# Altium project buck coverter LMR14030SDDAR.PrjPcb
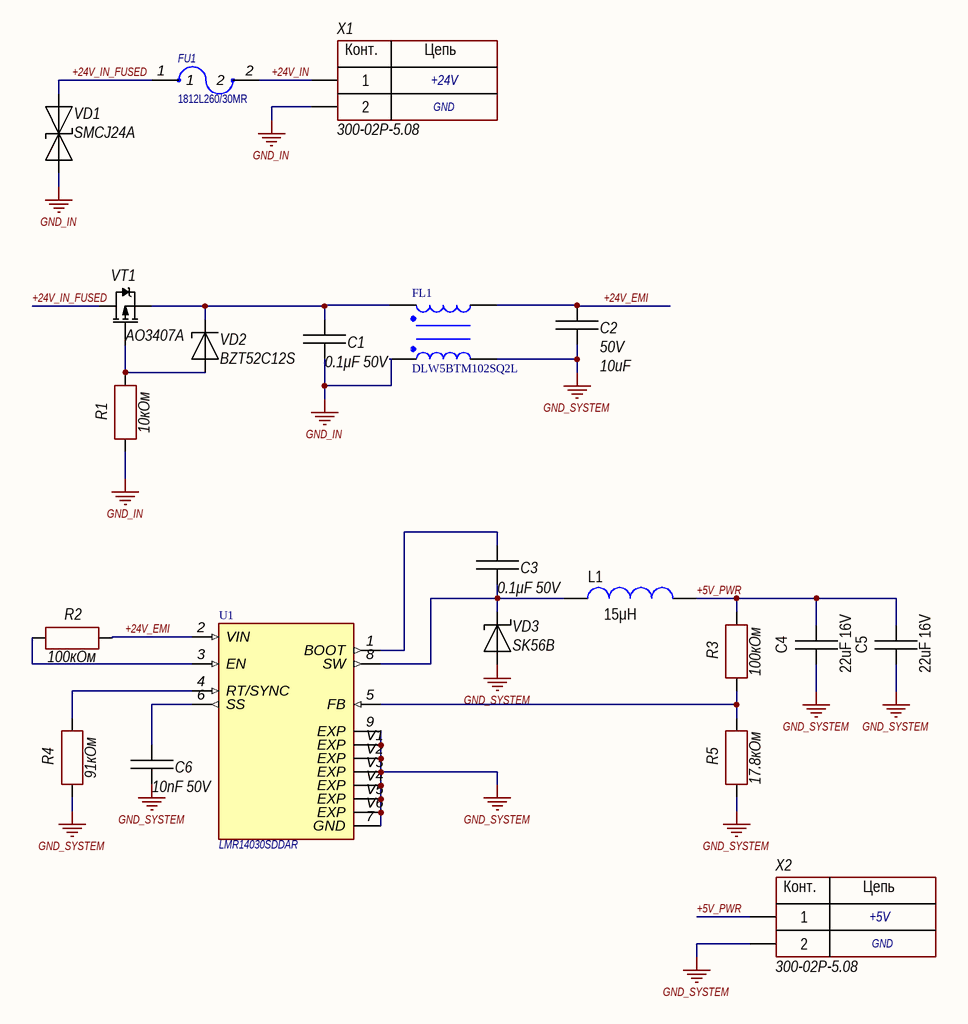
[diagram p0: converter schematic.SchDoc]
1 sheet, 21 parts. Net scope: global (net labels, ports and power ports of the same name join across sheets).
Board file: converter pcb.PcbDoc

## Sheet converter schematic.SchDoc
size 209 x 297 mm

### Parts
C1  value 0.1μF 50V  [CAP: 0603]
C2  value 10uF  Voltage: 50V  [CAP: 1210]
C3  value 0.1μF 50V  [CAP: 0603]
C4  22uF 16V  [CH1206C]
C5  22uF 16V  [CH1206C]
C6  value 10nF 50V  [CAP: 0603]
FL1  DLW5BTM102SQ2L  [FIL_DLW5BTM102SQ2L]
FU1  1812L260/30MR  [FUSM4632X200N]
L1  SRP1265A-150M: 15μH  [IND: SRP1265A]
R1  10кОм  [CH0603R]
R2  100кОм  [CH0603R]
R3  100кОм  [CH0603R]
R4  91кОм  [CH0603R]
R5  17.8кОм  [CH0603R]
U1  LMR14030SDDAR  [SOIC127P600X170-9N]
VD1  SMCJ24A  [SMC]
VD2  BZT52C12S  [SOD323]
VD3  PartNumber: SK56B  [DIODE: SMB]
VT1  AO3407A  [SOT23_132]
X1  300-02P-5.08  [CON: 300-02P-5.08]
X2  300-02P-5.08  [CON: 300-02P-5.08]

### Nets
GND_IN: C1.1 FL1.4 R1.1 VD1.2(C) X1.2
GND_SYSTEM: C2.1 C4.1 C5.1 C6.1 FL1.3 R4.1 R5.1 U1.7(GND) U1.9(EXP) U1.V1(EXP) U1.V2(EXP) U1.V3(EXP) U1.V4(EXP) U1.V5(EXP) U1.V6(EXP) VD3.1 X2.2
+5V_PWR: C4.2 C5.2 L1.1 R3.2 X2.1
+24V_EMI: C2.2 FL1.2 R2.2 U1.2(VIN)
+24V_IN: FU1.2 X1.1
+24V_IN_FUSED: FU1.1 VD1.1(A) VT1.2(D)
NetC1_2: C1.2 FL1.1 VD2.2(C) VT1.3(S)
NetC3_1: C3.1 L1.2 U1.8(SW) VD3.2
NetC3_2: C3.2 U1.1(BOOT)
NetC6_2: C6.2 U1.6(SS)
NetR1_2: R1.2 VD2.1(A) VT1.1(G)
NetR2_1: R2.1 U1.3(EN)
NetR3_1: R3.1 R5.2 U1.5(FB)
NetR4_2: R4.2 U1.4(RT/SYNC)

### Notes on the sheet
- +24V
- GND
- +5V
- Подп. и дата
- Инв. № дубл.
- Взам. инв. №
- Инв. № подл.
- Изм.
- Лист
- № докум.
- Подп.
- Дата
- Форма 2а ГОСТ 2.104-2006
- Копировал
- Формат А4
- (in symbol 2-Connector) Конт.; Цепь

### Library data of the parts
C1 C3 C6 = Ceramic_0603: Manufacturer: Yageo; PartNumber: CC0603KRX7R7BB104; TypeCapacitor: Ceramic capacitor; Tolerance: ±10%; TypeDielectric: X7R; Package: 0603; HelpURL: https://www.digikey.com/product-detail/en/yageo/CC0603KRX7R7BB104/311-1088-1-ND/302998; ValueManufacturerPartNumber: =TypeCapacitor+', '+Value+', '+TypeDielectric+', '+Tolerance+', '+Voltage+', '+Package+', '+Temperature; Temperature: -55...+125°C
C2 = Ceramic_1210: Manufacturer: Yageo; PartNumber: CC1210KKX7R9BB104; ValueManufacturerPartNumber: Ceramic capacitor, 10uF, X7R, ±10%, 50V, 1210, -55...+125°C; TypeCapacitor: Ceramic capacitor; Tolerance: ±10%; TypeDielectric: X7R; Package: 1210; HelpURL: https://www.digikey.com/product-detail/en/yageo/CC1210KKX7R9BB104/311-4522-1-ND/8025611; Temperature: -55...+125°C
C4 C5 = Capacitor: Manufacturer: *; Model: *; HelpURL: *; ComponentKind: *; Value: *
FL1 = DLW5BTM102SQ2L: 2 Line Common Mode Choke Surface Mount 1 kOhms @ 100MHz 2A DCR 34mOhm; MF: Murata; Price: None; Availability: Unavailable; SnapEDA_Link: https://www.snapeda.com/parts/DLW5BTM102SQ2L/Murata/view-part/4300900/?ref=snap; MP: DLW5BTM102SQ2L; Value: *; Package: Horizontal-6 Murata
FU1 = 1812L110PRT: PTC Resettable Fuse 1.1A(hold) 1.95A(trip) 33VDC 20A 0.8W 0.5s 0.06Ohm SMD Solder Pad 1812 T/R; Package: None; Price: None; Value: *; MP: 1812L110PRT; Availability: Unavailable
L1 = Inductor_SRP1265A: Manufacturer: Bourns; PartNumber: SRP1265A-4R7M; TypeInductor: Fixed inductor; MaxCurrent: 13.5A; Package: SRP1265A; HelpURL: https://www.digikey.com/product-detail/en/bourns-inc/SRP1265A-4R7M/SRP1265A-4R7MCT-ND/4876721; ValueManufacturerPartNumber: =TypeInductor+', '+Value+', '+Tolerance+', '+Package+', '+MaxCurrent+', '+Temperature; Temperature: -40...+150°C
R1 = Resistor: Manufacturer: *; Model: *; HelpURL: *; ComponentKind: *; Value: 10кОм
R2-R5 = Resistor: Value: 10кОм; Manufacturer: *; Model: *; HelpURL: *; ComponentKind: *
U1 = LMR14030SDDAR: SIMPLE SWITCHERÂ® 40-V, 3.5-A, 2.2-MHz step-down converter with 40-uA IQ; MF: Texas Instruments; SnapEDA_Link: https://www.snapeda.com/parts/LMR14030SDDAR/Texas+Instruments/view-part/?ref=snap; Package: HSOIC-8 Texas Instruments; Value: *; MP: LMR14030SDDAR; Check_prices: https://www.snapeda.com/parts/LMR14030SDDAR/Texas+Instruments/view-part/?ref=eda
VD1 = TVS-diod: ComponentKind: *; Manufacturer: *; Model: *; HelpURL: *
VD2 = Diod Zener: ComponentKind: *; Manufacturer: *; Model: *; HelpURL: *
VD3 = Schottky_single: Manufacturer: Diodes Incorporated; ValueManufacturerPartNumber: Schottky diode, 80V, 500mA, 1V, 15pF, SOD-123, -55...+150°C; TypeDiode: Schottky diode; Voltage: 80V; Current: 500mA; VoltageDrop: 1V; RecoveryTime: 15pF; Package: SOD-123; HelpURL: https://www.digikey.com/product-detail/en/diodes-incorporated/MBR0580S1-7/MBR0580S1-7DICT-ND/5080371; Temperature: -55...+150°C
VT1 = P-chanel: Mosfet; Model: *; Manufacturer: *; ComponentKind: *; HelpURL: *
X1 X2 = 2-Connector: Model: *; Manufacturer: *; HelpURL: *; ComponentKind: *